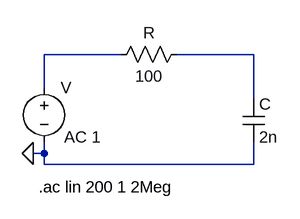
[diagram p0: schematic 3-1.asc]
3-1.asc, the LTspice schematic file:
Version 4.1
SHEET 1 880 680
WIRE 160 48 48 48
WIRE 352 48 240 48
WIRE 48 96 48 48
WIRE 352 112 352 48
WIRE 48 192 48 176
WIRE 48 192 32 192
WIRE 48 208 48 192
WIRE 352 208 352 176
WIRE 352 208 48 208
FLAG 32 192 0
SYMBOL voltage 48 80 R0
WINDOW 123 29 88 Left 2
WINDOW 39 0 0 Left 0
SYMATTR Value2 AC 1
SYMATTR InstName V
SYMATTR Value ""
SYMBOL res 256 32 R90
WINDOW 0 0 56 VBottom 2
WINDOW 3 32 56 VTop 2
SYMATTR InstName R
SYMATTR Value 100
SYMBOL cap 336 112 R0
SYMATTR InstName C
SYMATTR Value 2n
TEXT 40 240 Left 2 !.ac lin 200 1 2Meg

The netlist it stands for:
* 3-1.asc
V N001 0 AC 1
R N002 N001 100
C N002 0 2n
.ac lin 200 1 2Meg
.backanno
.end